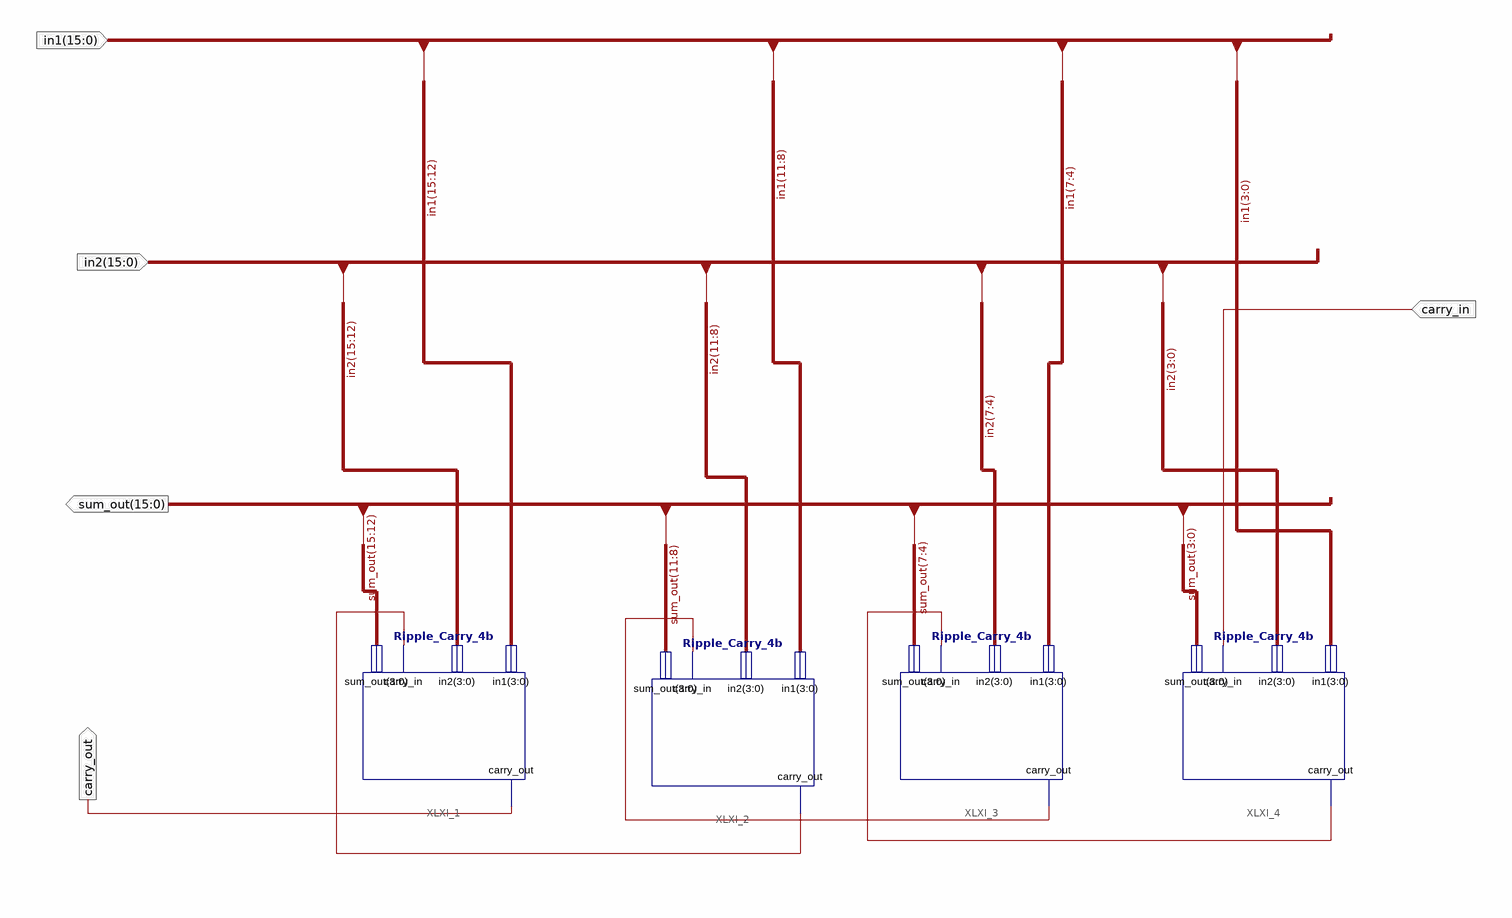
[diagram p0: schematic sheet 1]
// Xilinx ISE schematic Ripple_Carry_16b.sch (spartan3e) as structural Verilog: 4 symbols, 5 ports
module Ripple_Carry_16b (
  input  [15:0] in2,
  input  [15:0] in1,
  input  carry_in,
  output [15:0] sum_out,
  output carry_out
);

  wire XLXN_16, XLXN_17, XLXN_18;

  Ripple_Carry_4b XLXI_1 (
    .in1(in1[15:12]), .in2(in2[15:12]), .carry_in(XLXN_18), .carry_out(carry_out), .sum_out(sum_out[15:12]));
  Ripple_Carry_4b XLXI_2 (
    .in1(in1[11:8]), .in2(in2[11:8]), .carry_in(XLXN_17), .carry_out(XLXN_18), .sum_out(sum_out[11:8]));
  Ripple_Carry_4b XLXI_3 (
    .in1(in1[7:4]), .in2(in2[7:4]), .carry_in(XLXN_16), .carry_out(XLXN_17), .sum_out(sum_out[7:4]));
  Ripple_Carry_4b XLXI_4 (
    .in1(in1[3:0]), .in2(in2[3:0]), .carry_in(carry_in), .carry_out(XLXN_16), .sum_out(sum_out[3:0]));
endmodule
